# EAGLE design light-meter-B (EAGLE 6.5.0)
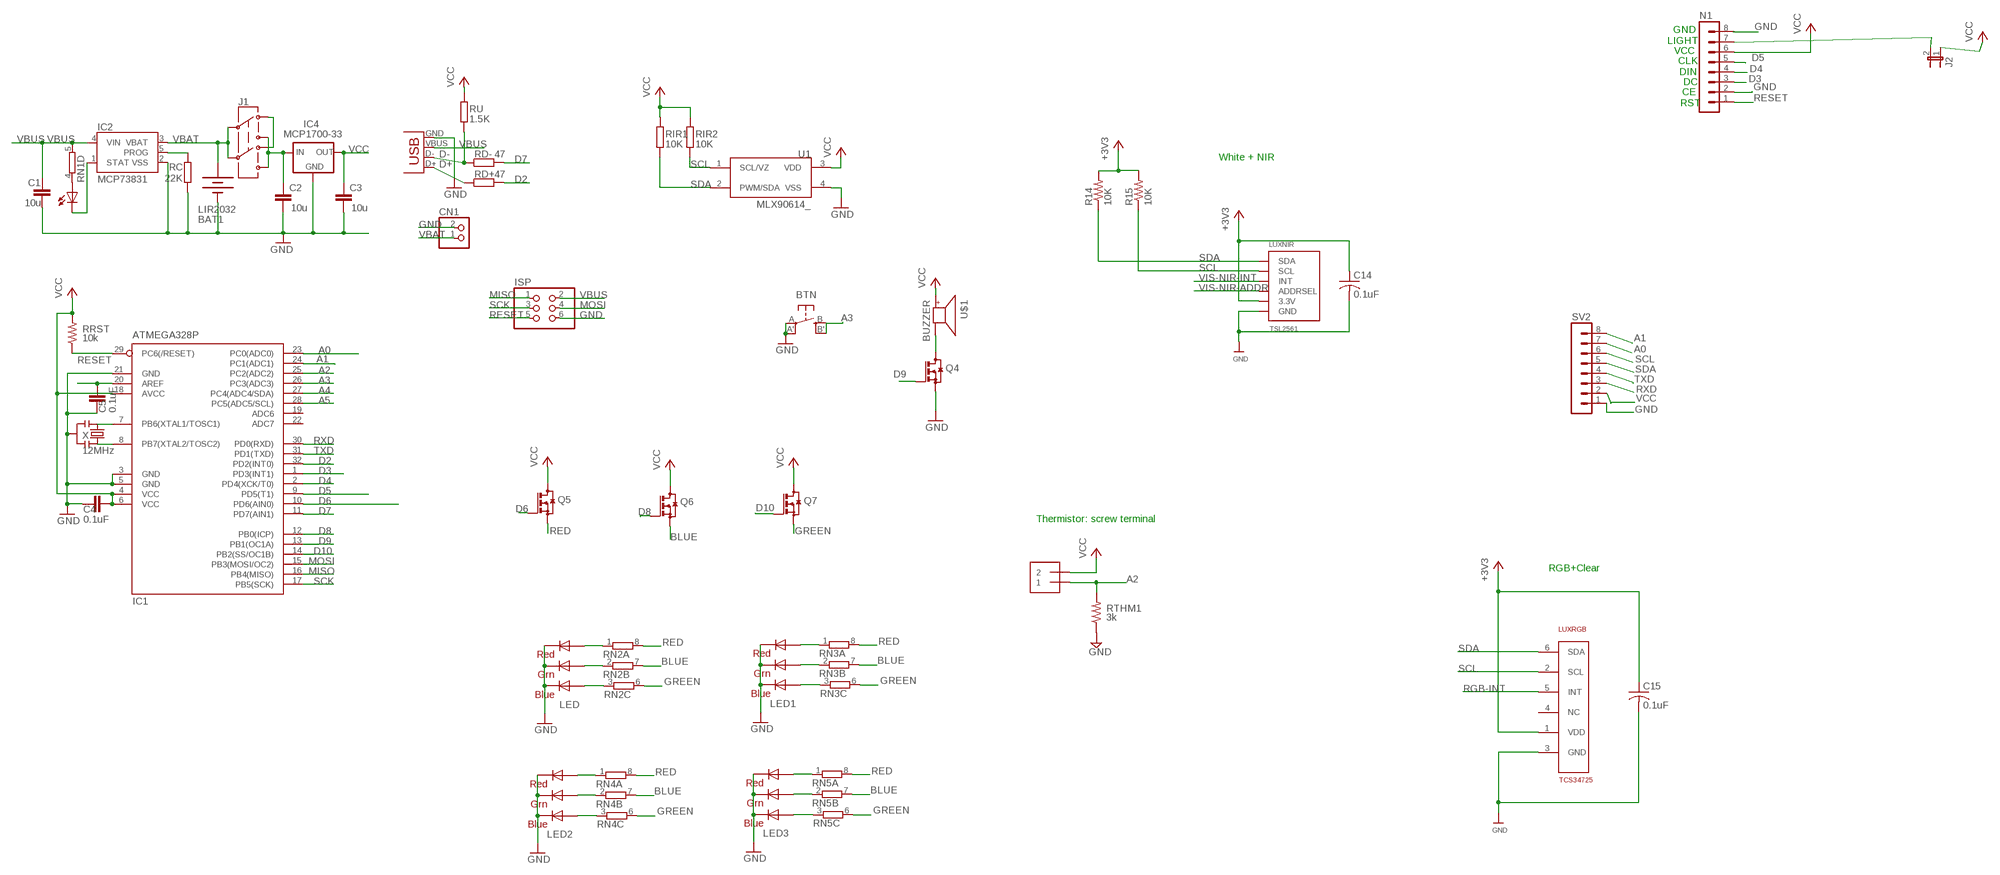
[diagram p0: schematic, sheet 1]

## Parts
BAT1  LIR2032  BATTERYBATTCOM_20MM_PTH_SMT  [BATTCOM_20MM_PTH_SMT]
BTN  EVQQ2  [EVQ-Q2]
C1  10u  C-EUC0805  [C0805]
C2  10u  C-EUC0805  [C0805]
C3  10u  C-EUC0805  [C0805]
C4  0.1uF  C-EUC0805  [C0805]
C5  0.1uF  C-EUC0805  [C0805]
C14  0.1uF  C-USC0805  [C0805]
C15  0.1uF  C-USC0805  [C0805]
CHG  0805  LEDCHIPLED_0805  [CHIPLED_0805]
CN1  JST_2PIN-SMT-RA  [JST-PH-2-SMT-RA]
IC1  ATMEGA328P  MEGA8-AI  [TQFP32-08]
IC2  MCP73831  [SOT23-5]
IC4  MCP1700-33  MCP1700SOT233  [SOT23]
ISP  PINHD-2X3  [2X03]
J1  AYZ0202  [AYZ0202]
J2  JP1E  [JP1]
LED  RGBLED5050  [RGBLED5050]
LED1  RGBLED5050  [RGBLED5050]
LED2  RGBLED5050  [RGBLED5050]
LED3  RGBLED5050  [RGBLED5050]
LUXNIR  TSL2561  [TSL2561_FN@1]
LUXRGB  TCS34725  [DFN-6]
N1  MA08-1  [MA08-1]
Q4  BSS123  [SOT23]
Q5  BSS123  [SOT23]
Q6  BSS123  [SOT23]
Q7  BSS123  [SOT23]
R14  10K  R-US_R0805  [R0805]
R15  10K  R-US_R0805  [R0805]
RC  22K  R-EU_R0805  [R0805]
RD+  47  R-EU_R0805  [R0805]
RD-  47  R-EU_R0805  [R0805]
RIR1  10K  R-EU_R0805  [R0805]
RIR2  10K  R-EU_R0805  [R0805]
RN1  4R-NEXB38V  [EXB38V]
RN2  4R-NEXB38V  [EXB38V]
RN3  4R-NEXB38V  [EXB38V]
RN4  4R-NEXB38V  [EXB38V]
RN5  4R-NEXB38V  [EXB38V]
RRST  10k  R-US_R0805  [R0805@1]
RTHM1  3k  R-US_R0805  [R0805@1]
RU  1.5K  R-EU_R0805  [R0805]
SV2  MA08-1  [MA08-1]
THM1  1X2-3.5MM  [1X2-3.5MM]
U1  MLX90614_  [TO-39]
U$1  BUZZER  [SMT-8585-BUZZER]
X  12MHz  RESONATORSMD  [RESONATOR-SMD]
X1  USBSMD  [USB-MINIB]

## Nets
+3V3: C14.1 C15.1 LUXNIR.VDD(3.3V) LUXRGB.1(VDD) R14.2 R15.2
A0: IC1.23(PC0(ADC0)) SV2.7
A1: IC1.24(PC1(ADC1)) SV2.8
A2: IC1.25(PC2(ADC2)) RTHM1.2 THM1.1
A3: BTN.B'(S1) BTN.B(S) IC1.26(PC3(ADC3))
A4: IC1.27(PC4(ADC4/SDA))
A5: IC1.28(PC5(ADC5/SCL))
AREF: C5.2 IC1.20(AREF)
BLUE: Q6.2(S) RN2.7 RN3.7 RN4.7 RN5.7
D2: IC1.32(PD2(INT0)) RD+.2
D3: IC1.1(PD3(INT1)) N1.3
D4: IC1.2(PD4(XCK/T0)) N1.4
D5: IC1.9(PD5(T1)) N1.5
D6: IC1.10(PD6(AIN0)) Q5.1(G)
D7: IC1.11(PD7(AIN1)) RD-.2
D8: IC1.12(PB0(ICP)) Q6.1(G)
D9: IC1.13(PB1(OC1A)) Q4.1(G)
D10: IC1.14(PB2(SS/OC1B)) Q7.1(G)
D+: RD+.1 X1.D+
D-: RD-.1 RU.1 X1.D-
GND: BAT1.P$1(-) BTN.A'(P1) BTN.A(P) C1.2 C2.2 C3.2 C4.1 C5.1 C14.2 C15.2 CN1.2 IC1.3(GND) IC1.5(GND) IC1.21(GND) IC2.2(VSS) IC4.1(GND) ISP.6 LED1.4(BLUE_C) LED1.5(RED_C) LED1.6(GREEN_C) LED2.4(BLUE_C) LED2.5(RED_C) LED2.6(GREEN_C) LED3.4(BLUE_C) LED3.5(RED_C) LED3.6(GREEN_C) LED.4(BLUE_C) LED.5(RED_C) LED.6(GREEN_C) LUXNIR.VSS(GND) LUXRGB.3(GND) N1.2 N1.8 Q4.2(S) RC.1 RTHM1.1 SV2.1 U1.4(VSS) X1.GND X.2
GREEN: Q7.2(S) RN2.6 RN3.6 RN4.6 RN5.6
MISO: IC1.16(PB4(MISO)) ISP.1
MOSI: IC1.15(PB3(MOSI/OC2)) ISP.4
N$1: J1.3 J1.6
N$2: IC1.7(PB6(XTAL1/TOSC1)) X.1
N$3: IC1.8(PB7(XTAL2/TOSC2)) X.3
N$4: LED.3(BLUE_A) RN2.3
N$5: CHG.C IC2.1(STAT)
N$6: IC2.5(PROG) RC.2
N$7: Q4.3(D) U$1.-
N$8: J2.2 N1.7
N$9: LED.1(GREEN_A) RN2.2
N$10: CHG.A RN1.4
N$11: LED.2(RED_A) RN2.1
N$12: LED1.3(BLUE_A) RN3.3
N$13: LED1.1(GREEN_A) RN3.2
N$14: LED1.2(RED_A) RN3.1
N$15: LED2.3(BLUE_A) RN4.3
N$16: LED2.1(GREEN_A) RN4.2
N$17: LED2.2(RED_A) RN4.1
N$18: LED3.3(BLUE_A) RN5.3
N$19: LED3.1(GREEN_A) RN5.2
N$20: LED3.2(RED_A) RN5.1
RED: Q5.2(S) RN2.8 RN3.8 RN4.8 RN5.8
RESET: IC1.29(PC6(/RESET)) ISP.5 N1.1 RRST.1
RGB-INT: LUXRGB.5(INT)
RXD: IC1.30(PD0(RXD)) SV2.3
SCK: IC1.17(PB5(SCK)) ISP.3
SCL: LUXNIR.CLK(SCL) LUXRGB.2(SCL) R15.1 RIR2.1 SV2.6 U1.1(SCL/VZ)
SDA: LUXNIR.DATA(SDA) LUXRGB.6(SDA) R14.1 RIR1.1 SV2.5 U1.2(PWM/SDA)
TXD: IC1.31(PD1(TXD)) SV2.4
VBAT: BAT1.P$2(+) CN1.1 IC2.3(VBAT) J1.2 J1.5
VBUS: C1.1 IC2.4(VIN) ISP.2 RN1.5 X1.VBUS
VCC: C3.1 C4.2 IC1.4(VCC) IC1.6(VCC) IC1.18(AVCC) IC4.2(OUT) J2.1 N1.6 Q5.3(D) Q6.3(D) Q7.3(D) RIR1.2 RIR2.2 RRST.2 RU.2 SV2.2 THM1.2 U1.3(VDD) U$1.+
VDD: C2.1 IC4.3(IN) J1.1 J1.4
VIS-NIR-ADDR: LUXNIR.ADR(ADDRSEL)
VIS-NIR-INT: LUXNIR.INT
Unconnected: IC1.19(ADC6) IC1.22(ADC7) LUXRGB.4(NC) RN1.1 RN1.2 RN1.3 RN1.6 RN1.7 RN1.8 RN2.4 RN2.5 RN3.4 RN3.5 RN4.4 RN4.5 RN5.4 RN5.5

## Notes on the sheet
- GND
- LIGHT
- VCC
- CLK
- DIN
- DC
- CE
- RST
- White + NIR
- Thermistor: screw terminal
- RGB+Clear

## Library data of the parts
BAT1 = SparkFunNew:BATTERY: Battery Holders Various common sizes : AA, AAA, 20mm coin cell and 12mm coin cell.
BTN = adafruit:EVQQ2: SMT 6mm switch, EVQQ2 series http://www.ladyada.net/library/eagle
C1-C3 = resistor:C-EU: CAPACITOR, European symbol
C4 C5 = rcl:C-EU: CAPACITOR, European symbol
C14 C15 = adafruit:C-US: CAPACITOR, American symbol
CHG = led:LED: LED OSRAM: - CHIPLED LG R971, LG N971, LY N971, LG Q971, LY Q971, LO R971, LY R971 LH N974, LH R974 LS Q976, LO Q976, LY Q976 LO Q996 - Hyper CHIPLED LW Q18S LB Q993, LB Q99A, LB R99A - SideLED LS A670, LO A670, LY A670, LG A670, LP A670 LB A673, LV A673, LT A673, LW A673 LH A674 LY A675 LS A676, LA A676, LO A676, LY A676, LW A676 LS A679, LY A679, LG A679 - Hyper Micro SIDELED® LS Y876, LA Y876, LO Y876, LY Y876 LT Y87S - SmartLED LW L88C, LW L88S LB L89C, LB L89S, LG L890 LS L89K, LO L89K, LY L89K LS L896, LA L896, LO L896, LY L896 - TOPLED LS T670, LO T670, LY T670, LG T670, LP T670 LSG T670, LSP T670, LSY T670, LOP T670, LYG T670 LG T671, LOG T671, LSG T671 LB T673, LV T673, LT T673, LW T673 LH T674 LS T676, LA T676, LO T676, LY T676, LB T676, LH T676, LSB T676, LW T676 LB T67C, LV T67C, LT T67C, LS T67K, LO T67K, LY T67K, LW E67C LS E67B, LA E67B, LO E67B, LY E67B, LB E67C, LV E67C, LT E67C LW T67C LS T679, LY T679, LG T679 LS T770, LO T770, LY T770, LG T770, LP T770 LB T773, LV T773, LT T773, LW T773 LH T774 LS E675, LA E675, LY E675, LS T675 LS T776, LA T776, LO T776, LY T776, LB T776 LHGB T686 LT T68C, LB T68C - Hyper Mini TOPLED® LB M676 - Mini TOPLED Santana® LG M470 LS M47K, LO M47K, LY M47K Source: http://www.osram.convergy.de LUXEON: - LUMILED® LXK2-PW12-R00, LXK2-PW12-S00, LXK2-PW14-U00, LXK2-PW14-V00 LXK2-PM12-R00, LXK2-PM12-S00, LXK2-PM14-U00 LXK2-PE12-Q00, LXK2-PE12-R00, LXK2-PE12-S00, LXK2-PE14-T00, LXK2-PE14-U00 LXK2-PB12-K00, LXK2-PB12-L00, LXK2-PB12-M00, LXK2-PB14-N00, LXK2-PB14-P00, LXK2-PB14-Q00 LXK2-PR12-L00, LXK2-PR12-M00, LXK2-PR14-Q00, LXK2-PR14-R00 LXK2-PD12-Q00, LXK2-PD12-R00, LXK2-PD12-S00 LXK2-PH12-R00, LXK2-PH12-S00 LXK2-PL12-P00, LXK2-PL12-Q00, LXK2-PL12-R00 Source: www.luxeon.com KINGBRIGHT: KA-3528ASYC Source: www.kingbright.com
CN1 = adafruit:JST_2PIN: JST 2-Pin Connectors of various flavors SMT-RA (S2B-PH-SM4) 4UConnector #17311 SMT (B2B-PH-SM4) THM-RA (S2B-PH) THM (B2B-PH)
IC1 = atmel:MEGA8: MICROCONTROLLER 8 Kbytes FLASH, 1 kbytes SRAM, 512 bytes EEPROM, USART, 6-channel 10 bit ADC, 2-channel 8 bit ADC Pin compatible with Atmega48, ATMega88, ATMega168 Source: avr.lbr; MPN: ATMEGA8-16AU; OC_FARNELL: 9171371; OC_NEWARK: 73M8863
IC2 = SparkFunNew:MCP73831: Microchip's MCP73831 Miniature single cell, fully integrated Li-Ion, Li-polymer charge management controller http://ww1.microchip.com/downloads/en/DeviceDoc/21984a.pdf
IC4 = adafruit:MCP1700: VOLTAGE REGULATOR
ISP = pinhead:PINHD-2X3: PIN HEADER
J1 = SparkFunNew:AYZ0202: SPDT Slide Switch Simple SMD single-pull double-throw slide switch. Good for less than 350mA power switch, switching UARTs between devices, etc. Spark Fun Electronics SKU : COM-00597
J2 = jumper:JP1E: JUMPER
LED LED1-LED3 = adafruit:RGBLED: For 5050 RGB LEDs, the order of the LEDs may vary from one manufacturer to another!
LUXNIR = microbuilder:TSL2561: TSL2561 Light-To-Digital Sensor Mouser Part Numbers: CS (obsolete): 856-TSL2561CS DFN (cheapest): 856-TSL2561FN
LUXRGB = dwbLibrary:TCS34725
N1 SV2 = con-lstb:MA08-1: PIN HEADER; OC_FARNELL: unknown; OC_NEWARK: unknown
Q4-Q7 = transistor-small-signal:BSS123: N-CHANNEL MOS FET
R14 R15 = adafruit:R-US_: RESISTOR, American symbol
RC RD+ RD- RIR1 RIR2 RU = rcl:R-EU_: RESISTOR, European symbol
RN1-RN5 = resistor-dil:4R-N: Array Chip Resistor Source: RS Component / Phycomp; OC_FARNELL: unknown; OC_NEWARK: unknown
RRST RTHM1 = rcl:R-US_: RESISTOR, American symbol
THM1 = adafruit:1X2: 3.5mm Terminal block http://www.ladyada.net/library/pcb/eaglelibrary.html
U1 = SparkFun:MLX90614: Melexis IR Thermometer
U$1 = adafruit:BUZZER
X = SparkFunNew:RESONATOR: Resonator Small SMD resonator. This is the itty bitty 10/20MHz resonators with built in caps. CSTCE10M0G55 and CSTCE20M0V53. Footprint has been reviewed closely but hasn't been tested yet.
X1 = SparkFun:USB: USB Connectors USB-B-PTH is fully proven SKU : PRT-00139 USB-miniB is fully proven SKU : PRT-00587 USB-A-PCB is untested. USB-A-H is throughly reviewed, but untested. Spark Fun Electronics SKU : PRT-00437 USB-B-SMT is throughly reviewed, but untested. Needs silkscreen touching up. USB-A-S has not been used/tested USB-MB-H has not been used/tested

## Net classes
0 default: width 0.203 mm, clearance 0.203 mm
1 power: width 0.254 mm, clearance 0.203 mm

## Board
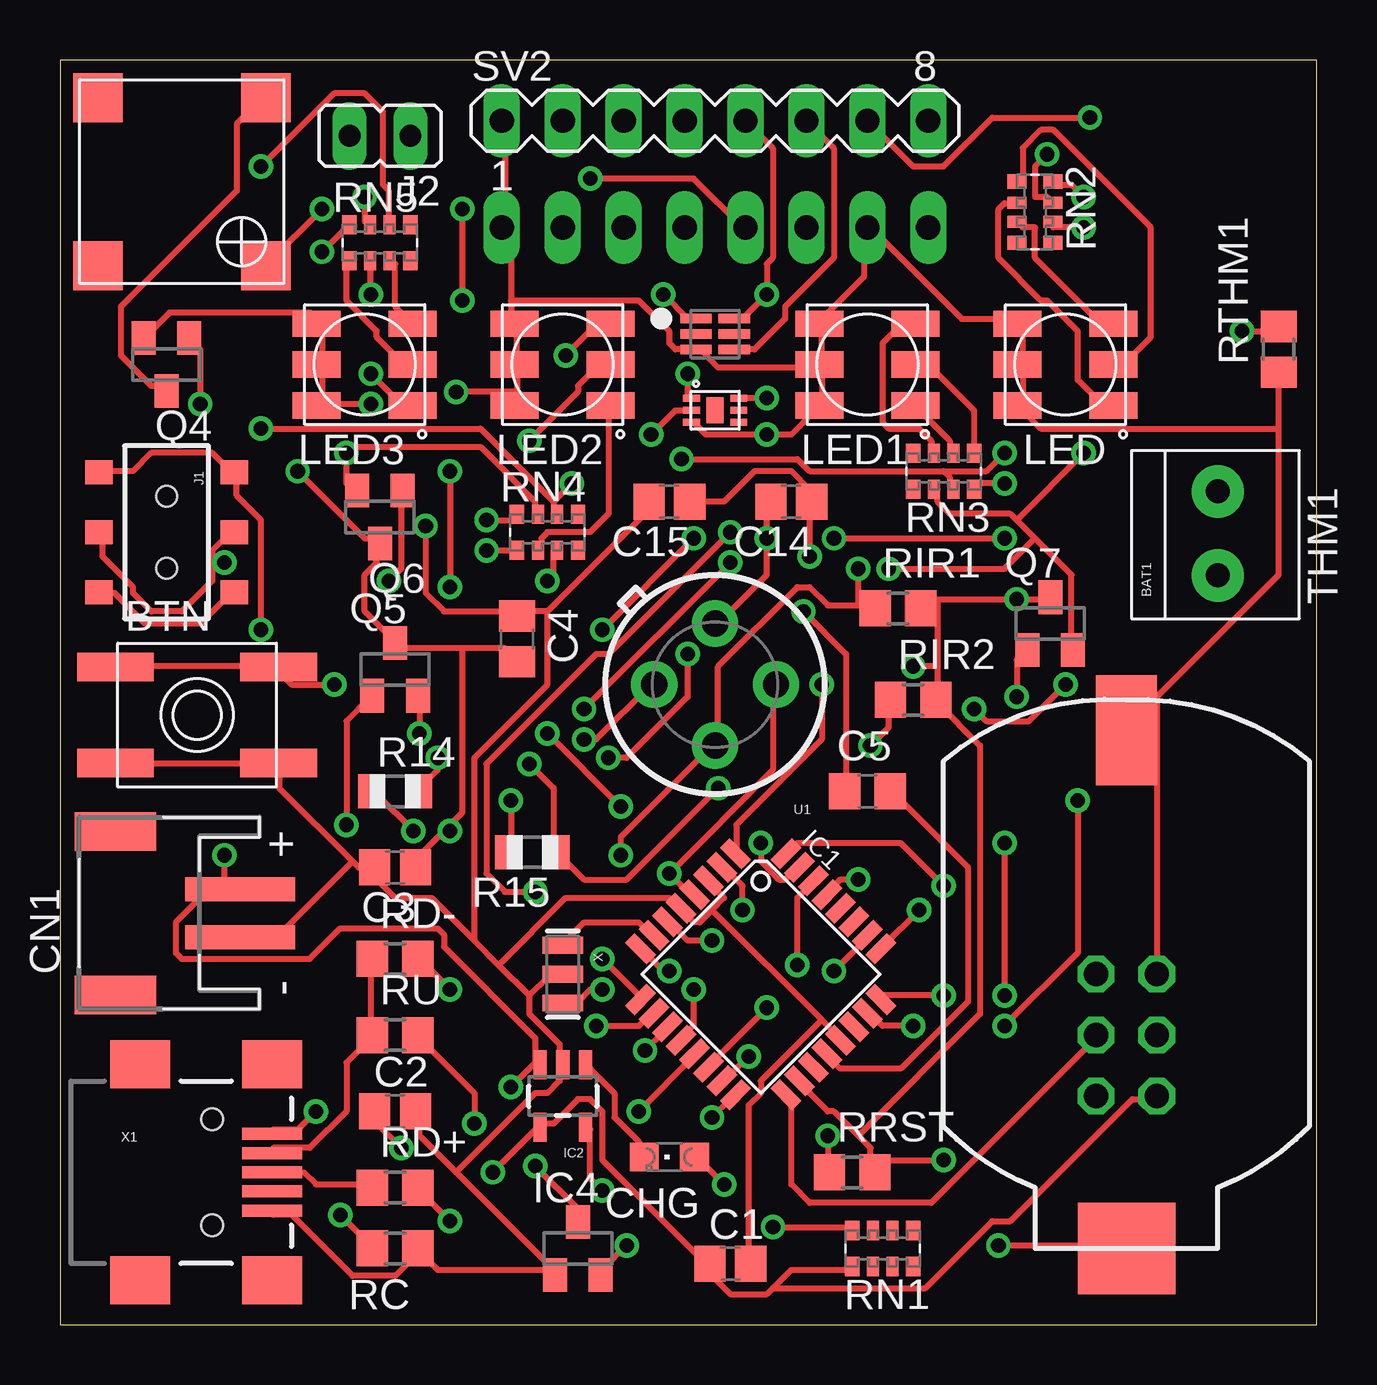
[diagram p1: board, top side]
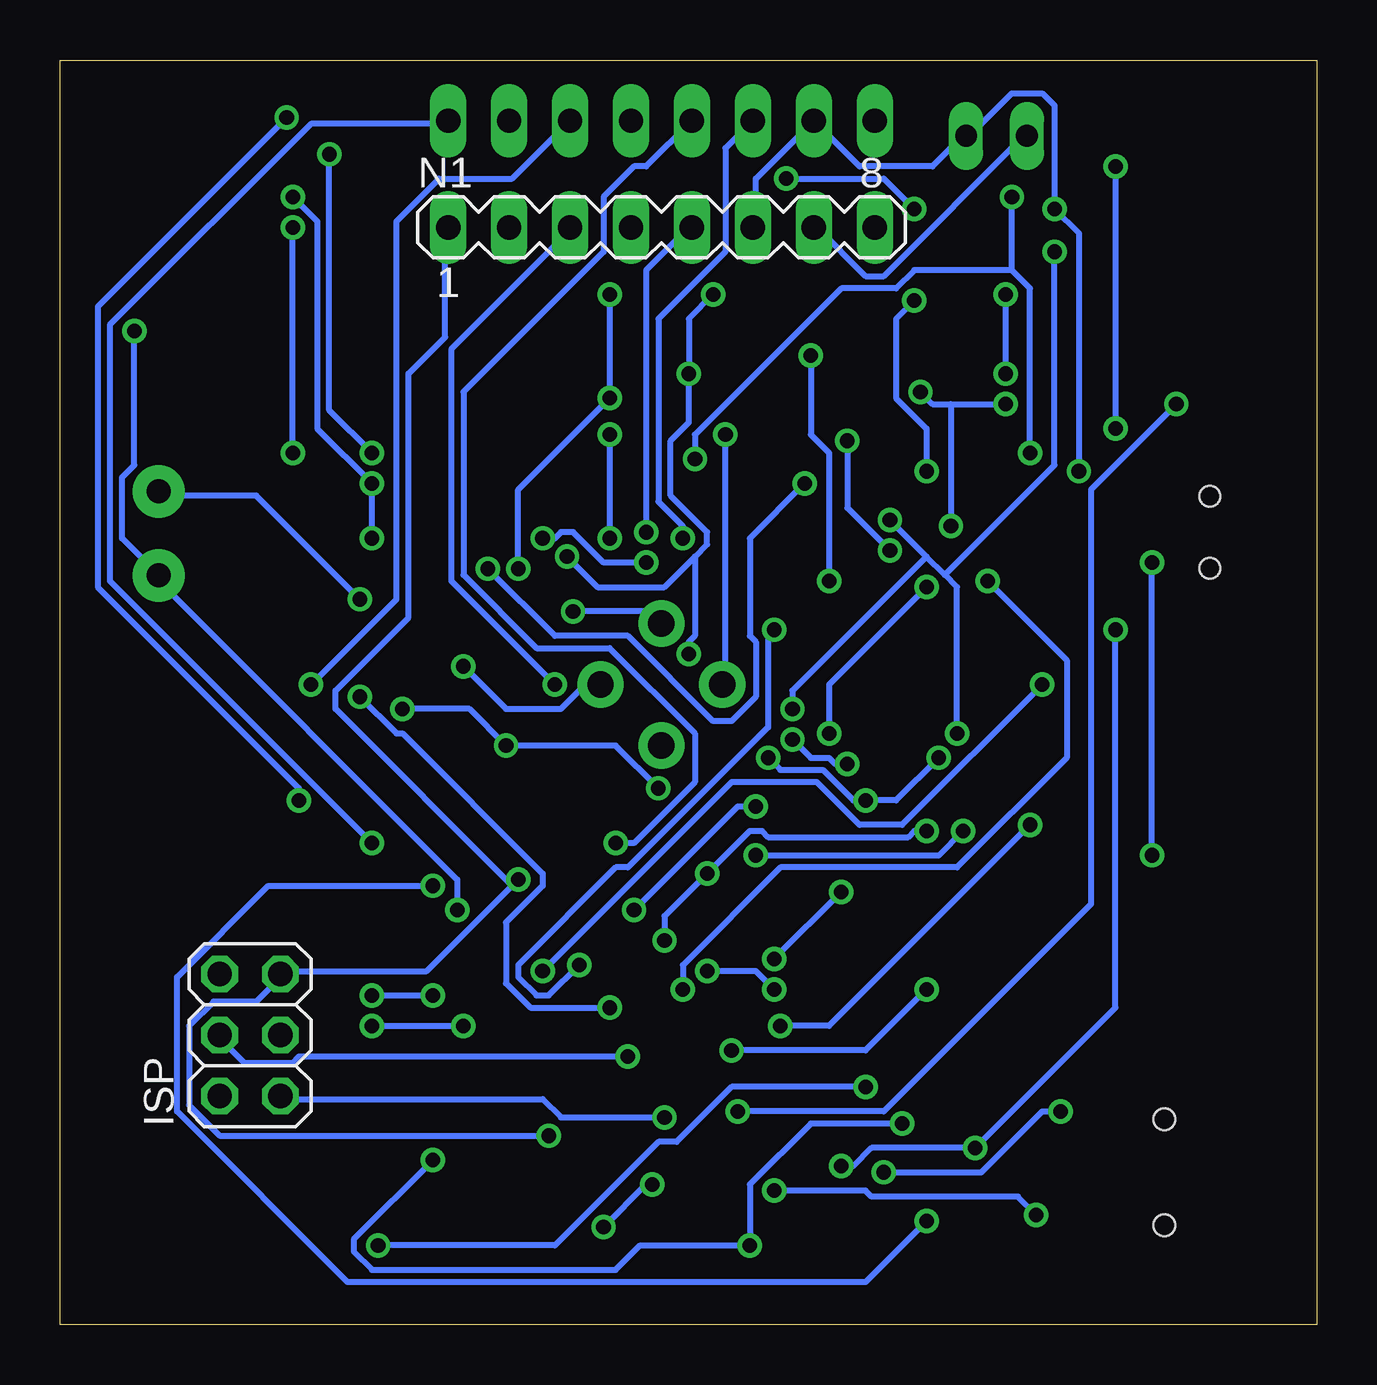
[diagram p2: board, bottom side, seen from below]

Size 52.38 x 52.7 mm. Coordinates in mm from the lower left corner, seen from the top.
Outline: 0,0 52.38,0 52.38,52.7 0,52.7 0,0
Copper layers (1*16): Top 0.035mm / dielectric 1.5mm / Bottom 0.035mm
Design rules "default": minimum track width 10mil, minimum drill 24mil, track to track 8mil, track to pad 8mil, pad to pad 8mil, via to via 8mil, smd to smd 8mil, copper to edge 40mil, drill to drill 8mil, minimum pad ring 10mil, minimum via ring 8mil, stop-mask expansion 4mil, vias tented up to drill 0mil, thermal gap 10mil

### Footprints (pad centres in the part's own frame; a part is rotated, then mirrored left to right if it is on the bottom)
BATTCOM_20MM_PTH_SMT = smd 4.572 x 2.54: P$1 0,0 | smd 3.81 x 4.064: P$2 21.59,0
EVQ-Q2 = smd 3.2 x 1.2: A -3.4,-2; A' 3.4,-2; B -3.4,2; B' 3.4,2
C0805 = smd 1.3 x 1.5: 1 -0.85,0; 2 0.85,0
C0805' = smd 1.3 x 1.5: 1 -0.95,0; 2 0.95,0
CHIPLED_0805 = smd 1.2 x 1.2: A 0,-1.05; C 0,1.05
JST-PH-2-SMT-RA = smd 1 x 4.6: 1 1,-3.7; 2 -1,-3.7 | smd 1.6 x 3.4: NC1 -3.4,1.5; NC2 3.4,1.5
TQFP32-08 = smd 1.27 x 0.559: 1 -4.293,2.8; 2 -4.293,2; 3 -4.293,1.2; 4 -4.293,0.4; 5 -4.293,-0.4; 6 -4.293,-1.2; 7 -4.293,-2; 8 -4.293,-2.8; 17 4.293,-2.8; 18 4.293,-2; 19 4.293,-1.2; 20 4.293,-0.4; 21 4.293,0.4; 22 4.293,1.2; 23 4.293,2; 24 4.293,2.8 | smd 0.559 x 1.27: 9 -2.8,-4.293; 10 -2,-4.293; 11 -1.2,-4.293; 12 -0.4,-4.293; 13 0.4,-4.293; 14 1.2,-4.293; 15 2,-4.293; 16 2.8,-4.293; 25 2.8,4.293; 26 2,4.293; 27 1.2,4.293; 28 0.4,4.293; 29 -0.4,4.293; 30 -1.2,4.293; 31 -2,4.293; 32 -2.8,4.293
SOT23-5 = smd 0.55 x 1.2: 1 -0.95,-1.3; 2 0,-1.3; 3 0.95,-1.3; 4 0.95,1.3; 5 -0.95,1.3
SOT23 = smd 1 x 1.4: 1 -0.95,-1.1; 2 0.95,-1.1; 3 0,1.1
2X03 = drill 1.016 octagon: 1 -2.54,-1.27; 2 -2.54,1.27; 3 0,-1.27; 4 0,1.27; 5 2.54,-1.27; 6 2.54,1.27
AYZ0202 = smd 1 x 1.15: 1 -2.5,2.825; 2 0,2.825; 3 2.5,2.825; 4 -2.5,-2.825; 5 0,-2.825; 6 2.5,-2.825 | hole 0.85: 1.5,0; -1.5,0
JP1 = drill 0.914 long: 1 0,-1.27; 2 0,1.27
RGBLED5050 = smd 2 x 1.1: 1 -2,1.7; 2 -2,0; 3 -2,-1.7; 4 2,-1.7; 5 2,0; 6 2,1.7
TSL2561_FN@1 = smd 1.3 x 0.4: ADR -0.8,0; CLK 0.8,-0.65; DATA 0.8,0.65; INT 0.8,0; VDD -0.8,0.65; VSS -0.8,-0.65
DFN-6 = smd 0.28 x 0.7: 1 -0.5,-0.988; 2 0,-0.988; 3 0.5,-0.988; 4 0.5,0.988; 5 0,0.988; 6 -0.5,0.988 | smd 1.1 x 0.7: P$1 0,0
MA08-1 = drill 1.016 long: 1 -8.89,0; 2 -6.35,0; 3 -3.81,0; 4 -1.27,0; 5 1.27,0; 6 3.81,0; 7 6.35,0; 8 8.89,0
R0805 = smd 1.1 x 1.4: 1 -1,0; 2 1,0
R0805' = smd 1.3 x 1.5: 1 -0.95,0; 2 0.95,0
EXB38V = smd 0.6 x 0.8: 1 -1.275,-0.75; 4 1.275,-0.75; 5 1.275,0.75; 8 -1.275,0.75 | smd 0.5 x 0.8: 2 -0.4,-0.75; 3 0.4,-0.75; 6 0.4,0.75; 7 -0.4,0.75
R0805@1 = smd 1.3 x 1.5: 1 -0.95,0; 2 0.95,0
1X2-3.5MM = drill 1 pad 2.184: 1 1.8,0; 2 -1.7,0
TO-39 = drill 1.1 pad 1.93: 1 2.54,0; 2 0,2.54; 3 -2.54,0; 4 0,-2.54
SMT-8585-BUZZER = smd 2.05 x 2.05: + -3.5,-3.5; - 3.5,-3.5; NC1 -3.5,3.5; NC2 3.5,3.5
RESONATOR-SMD = smd 0.7 x 1.7: 1 -1.2,0; 2 0,0; 3 1.2,0
USB-MINIB = smd 2.5 x 0.5: D+ 2.5,0; D- 2.5,0.8; GND 2.5,-1.6; ID 2.5,-0.8; VBUS 2.5,1.6 | smd 2.5 x 2: GND@1 -3,-4.5; GND@2 -3,4.5; GND@3 2.5,4.5; GND@4 2.5,-4.5 | hole 0.9: 0,2.2; 0,-2.2

### Placement (x,y rotation side)
BAT1  44.45,24.77 270 top
BTN  5.71,25.4 0 top
C1  27.94,2.54 0 top
C2  13.97,8.89 0 top
C3  13.97,19.05 180 top
C4  0.1uF  [C0805']  19.05,28.57 270 top
C5  0.1uF  [C0805']  33.66,22.23 0 top
C14  30.48,34.29 180 top
C15  25.4,34.29 180 top
CHG  25.4,6.99 90 top
CN1  3.81,17.14 90 top
IC1  29.21,14.61 315 top
IC2  20.95,9.53 180 top
IC4  21.59,3.17 0 top
ISP  44.45,12.06 90 bottom
J1  4.45,33.02 270 top
J2  13.34,49.53 90 top
LED  41.91,40.01 180 top
LED1  33.66,40.01 180 top
LED2  20.95,40.01 180 top
LED3  12.7,40.01 180 top
LUXNIR  27.3,41.27 0 top
LUXRGB  27.3,38.1 270 top
N1  27.3,45.72 0 bottom
Q4  4.45,40.01 180 top
Q5  13.97,27.3 0 top
Q6  13.34,33.66 180 top
Q7  41.27,29.21 0 top
R14  13.97,22.23 0 top
R15  19.68,19.68 180 top
RC  22K  [R0805']  13.97,3.17 180 top
RD+  47  [R0805']  13.97,5.71 0 top
RD-  47  [R0805']  13.97,15.24 0 top
RIR1  10K  [R0805']  34.92,29.84 0 top
RIR2  10K  [R0805']  35.56,26.04 0 top
RN1  34.29,3.17 180 top
RN2  40.64,46.35 270 top
RN3  36.83,35.56 180 top
RN4  20.32,33.02 0 top
RN5  13.34,45.09 0 top
RRST  33.02,6.35 0 top
RTHM1  50.8,40.64 90 top
RU  1.5K  [R0805']  13.97,12.06 0 top
SV2  27.3,50.16 0 top
THM1  48.26,33.02 270 top
U1  27.3,26.67 180 top
U$1  5.08,47.62 90 top
X  20.95,14.61 270 top
X1  6.35,6.35 0 top

### Tracks (layer width: path | path; a pad name or v marks a point on that pad's centre or on a via)
+3V3  (via drill 0.61)
  Top 0.254: v18.8,21.84 18.8,19.81 R15.2 | v15.75,23.62 15.75,23.11 14.99,22.35 R14.2 | v26.16,39.62 26.16,38.61 LUXRGB.1 | v25.15,42.93 26.16,41.91 26.42,41.91 LUXNIR.VDD | C15.1 27.69,34.29 28.96,35.56 30.48,35.56 31.24,34.8 31.24,34.29 | 31.24,34.29 v31.24,32 | 31.24,34.29 C14.1 | v22.86,23.62 23.62,23.62 26.16,26.16 v26.16,27.94
  Bottom 0.254: v15.75,23.62 17.53,21.84 v18.8,21.84 19.3,21.84 20.57,23.11 22.35,23.11 v22.86,23.62 | v25.15,42.93 26.16,41.91 v26.16,39.62 26.16,37.59 26.92,36.83 26.92,34.54 25.4,33.02 25.4,32.51 25.91,32 | 25.91,32 27.18,30.73 29.97,30.73 v31.24,32 | v26.16,27.94 26.16,28.45 25.91,28.7 25.91,32
A0  (via drill 0.61)
  Top 0.254: v35.56,12.45 34.29,12.45 33.78,12.95 IC1.23 | v39.37,12.45 42.42,15.49 v42.42,21.84 | v42.93,50.29 38.86,50.29 36.83,48.26 35.56,48.26 SV2.7
  Bottom 0.254: v39.37,12.45 v35.56,12.45 | v42.42,21.84 42.42,22.35 50.8,30.73 50.8,42.42 v42.93,50.29
A1  (via drill 0.61)
  Top 0.254: v36.83,13.72 34.29,13.72 IC1.24 | v39.37,20.07 v39.37,13.72
  Bottom 0.254: v39.37,13.72 v36.83,13.72 | v39.37,20.07 50.29,30.99 50.29,41.66 41.91,50.04 36.32,50.04 SV2.8
A2  (via drill 0.61)
  Top 0.254: v35.81,17.27 34.29,15.75 IC1.25 | v49.28,41.4 50.8,41.4 RTHM1.2
  Bottom 0.254: v35.81,17.27 35.81,18.54 48.26,30.99 THM1.1 48.26,31.24 49.78,32.77 49.78,35.31 49.28,35.81 v49.28,41.4
A3  (via drill 0.61)
  Top 0.254: v32.26,14.73 33.53,16 IC1.26 | v11.43,26.67 9.65,26.67 9.14,27.18 BTN.B' 8.89,27.43 2.54,27.43 BTN.B
  Bottom 0.254: v32.26,14.73 24.38,22.61 20.83,22.61 19.05,20.83 17.27,20.83 v11.43,26.67
AREF
  Top 0.254: IC1.20 32,11.18 32.51,10.67 35.05,10.67 37.85,13.46 37.85,19.05 34.8,22.1 C5.2
BLUE  (via drill 0.61)
  Top 0.254: v12.7,46.99 12.7,45.97 RN5.7 | Q6.2 12.19,34.8 11.94,35.05 v11.94,36.32 12.19,36.58 17.53,36.58 19.81,34.29 19.81,33.78 RN4.7 | 36.83,35.56 37.08,35.31 37.08,35.05 RN3.7 | 36.83,35.56 31.24,35.56 30.73,36.07 v25.91,36.07 | v41.15,48.77 40.64,48.26 40.64,46.99 41.15,46.99 RN2.7 | v39.37,36.32 38.61,35.56 36.83,35.56
  Bottom 0.254: 12.7,43.94 v12.7,46.99 | 12.7,43.94 11.94,43.18 v11.94,36.32 | v25.91,36.07 25.91,37.08 19.81,43.18 17.53,43.18 16.76,43.94 12.7,43.94 | v41.15,48.77 41.15,38.1 v39.37,36.32
D2  (via drill 0.61)
  Top 0.254: v36.83,18.29 35.05,20.07 30.73,20.07 30.48,19.81 IC1.32 | v16.26,4.32 14.99,5.59 RD+.2
  Bottom 0.254: v36.83,18.29 43.69,18.29 47.5,14.48 47.5,8.89 40.39,1.78 18.8,1.78 v16.26,4.32
D3  (via drill 0.61)
  Top 0.254: v31.75,26.67 31.75,24.38 28.19,20.83 28.19,19.81 IC1.1
  Bottom 0.254: v31.75,26.67 36.07,30.99 36.07,40.64 30.99,45.72 N1.3
D4  (via drill 0.61)
  Top 0.254: v28.45,17.27 28.45,18.29 27.69,19.05 IC1.2 | v20.32,24.64 v23.37,21.59 | v16.26,35.56 v16.26,30.73 | v16.76,46.48 v16.76,42.67 | v22.1,47.75 26.42,47.75 28.45,45.72 N1.4
  Bottom 0.254: v28.45,17.27 24.13,21.59 v23.37,21.59 | v20.32,24.64 20.32,26.67 v16.26,30.73 | v16.26,35.56 16.26,37.34 17.53,38.61 17.53,41.91 v16.76,42.67 | v16.76,46.48 18.03,47.75 v22.1,47.75
D5  (via drill 0.61)
  Top 0.254: v22.61,15.24 24.13,13.72 IC1.9 | v19.81,18.03 18.54,18.03 17.78,18.8 17.78,23.37 22.35,27.94 22.86,27.94 v27.94,33.02
  Bottom 0.254: v19.81,18.03 v22.61,15.24 | v27.94,33.02 27.94,43.94 26.16,45.72 N1.5
D6  (via drill 0.61)
  Top 0.254: v22.35,12.45 24.13,12.45 24.64,12.95 IC1.10 | v11.94,20.83 11.94,25.15 12.95,26.16 Q5.1
  Bottom 0.254: v22.35,12.45 20.32,12.45 v11.94,20.83
D7  (via drill 0.61)
  Top 0.254: v24.38,11.43 25.15,12.19 IC1.11 | v16.26,13.97 14.99,15.24 RD-.2
  Bottom 0.254: v24.38,11.43 18.8,11.43 v16.26,13.97
D8  (via drill 0.61)
  Top 0.254: v26.42,13.97 26.42,12.45 25.91,11.94 IC1.12 | v13.72,30.99 14.22,31.5 14.22,34.54 Q6.1
  Bottom 0.254: v26.42,13.97 26.42,14.99 22.35,19.05 14.99,19.05 10.41,23.62 10.41,27.69 v13.72,30.99
D9  (via drill 0.61)
  Top 0.254: v24.13,8.89 26.42,11.18 IC1.13 | v5.84,38.35 5.84,40.64 5.59,40.89 Q4.1
  Bottom 0.254: v24.13,8.89 18.03,8.89 9.4,17.53 9.4,34.8 v5.84,38.35
D10  (via drill 0.61)
  Top 0.254: v29.46,13.21 27.18,10.92 IC1.14 | v39.88,26.16 39.88,27.69 40.13,27.94 Q7.1
  Bottom 0.254: v29.46,13.21 32.77,13.21 33.78,14.22 33.78,16.76 32.26,18.29 32.26,18.8 38.1,24.64 38.35,24.64 v39.88,26.16
D+
  Top 0.254: X1.D+ 10.16,6.35 10.67,5.84 12.95,5.84 RD+.1
D-
  Top 0.254: RD-.1 12.95,15.24 12.95,12.19 RU.1 12.95,11.94 11.94,10.92 11.94,8.89 10.41,7.37 8.89,7.37 X1.D-
GND  (via drill 0.61)
  Top 0.254: 27.18,17.27 27.69,17.78 27.18,18.29 IC1.3 | 27.18,17.27 26.67,16.76 26.42,16.76 25.91,17.27 IC1.5 25.65,17.53 25.4,17.78 21.08,17.78 18.29,14.99 | 27.18,17.27 31.75,12.7 | 31.75,12.7 32.51,11.94 IC1.21 | 31.75,12.7 29.21,10.16 29.21,9.65 28.7,9.14 28.7,2.54 C1.2 | 20.57,2.29 15.75,2.29 14.99,3.05 | 20.57,2.29 16.51,6.35 | 16.51,6.35 14.99,7.87 14.99,8.89 C2.2 | 20.57,2.29 IC4.1 | 14.99,3.05 13.97,2.03 12.19,2.03 9.65,4.57 8.89,4.57 X1.GND | 14.99,3.05 RC.1 | 20.32,29.72 19.05,29.72 | 20.32,29.72 24.38,33.78 24.38,34.29 C15.2 | 19.56,13.72 19.56,12.95 20.83,11.68 20.83,10.92 IC2.2 20.83,10.67 20.83,10.16 20.32,9.65 19.81,9.65 16.51,6.35 | 19.56,13.72 20.32,14.48 20.83,14.48 X.2 | 12.7,19.05 12.45,19.05 12.19,19.3 | 12.7,19.05 C3.2 12.95,19.05 | 12.19,19.3 9.14,22.35 9.14,23.37 BTN.A' 8.89,23.37 2.54,23.37 BTN.A | 17.27,16 15.49,17.78 13.97,17.78 12.7,19.05 | 17.27,16 18.29,14.99 | 18.29,14.99 19.56,13.72 | 12.19,19.3 9.14,16.26 7.62,16.26 CN1.2 | 20.32,29.72 20.32,26.67 17.27,23.62 17.27,16 | 50.8,37.34 50.8,31.24 45.72,26.16 | 50.8,37.34 RTHM1.1 | 45.72,26.16 44.45,24.89 BAT1.P$1 | 45.72,26.16 ISP.6 | 10.92,38.35 10.92,39.88 LED3.5 10.92,40.13 10.92,41.66 LED3.4 10.67,41.91 10.41,42.16 4.57,42.16 3.56,41.15 Q4.2 | 19.05,38.86 19.05,39.88 LED2.5 19.05,40.13 19.05,41.66 LED2.4 18.8,41.91 18.8,42.67 | 19.05,38.86 19.05,38.35 LED2.6 | 18.54,45.72 18.54,50.04 SV2.1 | 18.8,42.67 18.8,45.47 18.54,45.72 | 18.54,45.72 N1.8 | v12.95,38.35 10.92,38.35 | 19.05,38.86 v16.51,38.86 | 10.92,38.35 LED3.6 | C14.2 29.46,34.29 v29.46,32.77 29.46,31.24 27.43,29.21 U1.4 | v30.99,29.72 32.77,27.94 32.77,22.35 C5.1
  Top 0.254: LUXRGB.3 26.42,37.59 26.92,37.08 v29.46,37.08 30.48,37.08 31.5,38.1 LED1.6 31.75,38.35 31.75,39.88 LED1.5 | LED1.5 31.5,39.88 27.43,39.88 26.67,40.64 LUXNIR.VSS 26.42,40.64 25.65,40.64 25.4,40.89 25.4,41.4 24.13,42.67 18.8,42.67 | LED1.5 31.75,40.13 31.75,41.66 LED1.4 31.75,41.91 33.53,43.69 33.53,45.72 N1.2 33.78,45.72 37.59,41.91 39.88,41.91 LED.4 40.13,41.66 40.13,40.13 LED.5 40.13,39.88 40.13,38.35 LED.6 40.13,38.1 40.89,37.34 50.8,37.34 | 19.05,29.72 16,29.72 15.24,30.48 v15.24,33.27 | 19.05,29.72 C4.1
  Bottom 0.254: 15.24,38.35 16,38.35 v16.51,38.86 | 15.24,38.35 v12.95,38.35 | v30.99,29.72 27.94,29.72 27.43,29.21 U1.4 | v29.46,37.08 v29.46,32.77 | 15.24,38.35 v15.24,33.27
GREEN  (via drill 0.61)
  Top 0.254: 40.64,32.77 42.16,31.24 42.16,28.19 Q7.2 | 40.64,32.77 39.88,33.53 | 39.88,33.53 39.62,33.78 37.08,33.78 36.58,34.29 36.58,34.8 RN3.6 | v42.67,45.72 41.4,45.72 RN2.6 | 39.88,33.53 v42.67,36.32 | 20.57,34.29 20.57,33.78 RN4.6 | 20.57,34.29 17.53,37.34 v8.38,37.34 | v8.38,48.26 11.43,51.31 12.7,51.31 13.46,50.55 13.46,47.5 13.72,47.24 13.72,45.97 RN5.6 | 40.64,32.77 39.37,31.5 v34.54,31.5 | 20.57,34.29 v21.34,35.05
  Bottom 0.254: v42.67,36.32 v42.67,45.72 | v8.38,48.26 v8.38,37.34 | v34.54,31.5 31.75,28.7 28.7,28.7 25.15,25.15 24.38,25.15 23.37,26.16 23.37,28.45 23.62,28.7 23.62,32.77 v21.34,35.05
MISO  (via drill 0.61)
  Top 0.254: v27.18,8.64 27.94,9.4 IC1.16
  Bottom 0.254: v27.18,8.64 31.5,8.64 32.26,9.4 43.18,9.4 ISP.1
MOSI  (via drill 0.61)
  Top 0.254: v28.7,11.18 27.69,10.16 IC1.15
  Bottom 0.254: v28.7,11.18 42.42,11.18 42.67,10.92 44.7,10.92 45.72,11.94 ISP.4
N$1
  Top 0.254: J1.6 1.78,30.48 2.29,30.48 3.56,29.21 5.84,29.21 7.11,30.48 J1.3
N$2
  Top 0.254: IC1.7 24.64,16.26 24.13,16.76 21.84,16.76 21.08,16 X.1
N$3  (via drill 0.61)
  Top 0.254: v25.4,14.73 25.15,14.73 24.38,15.49 IC1.8 | v22.61,13.97 22.1,13.97 21.59,13.46 21.08,13.46 X.3
  Bottom 0.254: v25.4,14.73 23.37,14.73 v22.61,13.97
N$4
  Top 0.254: RN2.3 40.13,45.72 40.64,45.72 40.64,44.45 43.18,41.91 43.69,41.91 LED.3
N$5
  Top 0.254: CHG.C 24.13,7.11 24.13,7.62 23.11,8.64 23.11,9.65 22.1,10.67 IC2.1
N$6  (via drill 0.61)
  Top 0.254: v22.61,5.59 22.1,6.1 22.1,8.13 IC2.5 | v11.68,4.57 12.95,3.3 RC.2
  Bottom 0.254: v22.61,5.59 18.8,5.59 18.54,5.33 12.45,5.33 v11.68,4.57
N$7
  Top 0.254: Q4.3 4.32,39.12 3.81,39.12 2.54,40.39 2.54,42.42 7.37,47.24 7.37,50.04 8.38,51.05 U$1.-
N$8
  Bottom 0.254: J2.2 12.19,49.53 18.03,43.69 18.8,43.69 20.83,45.72 N1.7
N$9
  Top 0.254: RN2.2 39.88,46.74 39.37,46.74 39.12,46.48 39.12,44.45 40.89,42.67 41.15,42.67 42.42,41.4 42.42,39.37 43.69,38.1 LED.1
N$10  (via drill 0.61)
  Top 0.254: v29.72,4.06 32.77,4.06 RN1.4 | v27.69,5.84 26.67,6.86 CHG.A
  Bottom 0.254: v29.72,4.06 27.94,5.84 v27.69,5.84
N$11
  Top 0.254: RN2.1 40.13,47.75 40.13,49.02 40.89,49.78 41.4,49.78 45.47,45.72 45.47,41.15 44.45,40.13 43.94,40.13 LED.2
N$12
  Top 0.254: RN3.3 36.32,36.32 36.32,36.83 35.81,37.34 34.54,37.34 34.29,37.59 34.29,40.89 35.05,41.66 35.56,41.66 LED1.3
N$13
  Top 0.254: RN3.2 37.08,36.32 37.08,36.83 35.81,38.1 LED1.1
N$14
  Top 0.254: RN3.1 38.1,36.32 38.1,38.1 36.32,39.88 35.81,39.88 LED1.2
N$15  (via drill 0.61)
  Top 0.254: v20.32,30.99 20.57,31.24 20.57,32.26 RN4.3 | v21.08,40.39 22.35,41.66 22.86,41.66 LED2.3
  Bottom 0.254: v20.32,30.99 20.32,36.32 21.08,37.08 v21.08,40.39
N$16
  Top 0.254: RN4.2 20.07,32.51 20.07,32.77 20.32,33.02 22.1,33.02 22.86,33.78 22.86,38.1 LED2.1
N$17  (via drill 0.61)
  Top 0.254: v17.78,32.26 18.8,32.26 RN4.1 | v19.56,36.83 21.59,38.86 21.59,39.12 22.35,39.88 22.86,39.88 LED2.2
  Bottom 0.254: v17.78,32.26 19.56,34.04 v19.56,36.83
N$18
  Top 0.254: RN5.3 13.97,44.2 13.97,42.42 14.48,41.91 LED3.3
N$19  (via drill 0.61)
  Top 0.254: v12.95,42.93 12.95,44.2 RN5.2 | v12.95,39.62 14.48,38.1 LED3.1
  Bottom 0.254: v12.95,39.62 v12.95,42.93
N$20
  Top 0.254: RN5.1 11.94,44.2 11.94,42.67 13.21,41.4 13.21,41.15 14.48,39.88 LED3.2
RED  (via drill 0.61)
  Top 0.254: v39.37,35.05 38.35,35.05 RN3.8 | v42.67,46.99 42.16,47.5 41.4,47.5 RN2.8 | v17.78,33.53 18.8,33.53 RN4.8 | v14.99,24.64 14.99,26.16 Q5.2 | v10.92,44.7 11.94,45.72 RN5.8 | v32.26,32.77 v39.37,32.77 | v21.84,25.65 v27.94,31.75
  Bottom 0.254: v42.67,46.99 41.66,45.97 41.66,37.34 v39.37,35.05 v39.37,32.77 | 15.49,31.24 14.99,30.73 v14.99,24.64 | 15.49,31.24 16.26,32 | 16.26,32 v17.78,33.53 | v10.92,44.7 10.92,35.81 15.49,31.24 | v32.26,32.77 31.75,32.77 31.5,33.02 30.99,33.02 29.72,31.75 v27.94,31.75 | v21.84,25.65 21.84,26.42 16.26,32
RESET  (via drill 0.61)
  Top 0.254: v33.27,18.54 32.51,18.54 32,18.03 IC1.29 | v32,7.87 32,6.35 RRST.1
  Bottom 0.254: 33.53,18.29 37.08,14.73 43.18,14.73 ISP.5 43.18,14.48 44.2,13.46 45.97,13.46 46.99,12.45 46.99,9.14 45.72,7.87 v32,7.87 | 33.53,18.29 40.89,25.65 40.89,26.42 37.85,29.46 37.85,39.62 36.32,41.15 36.32,45.72 N1.1 | 33.53,18.29 v33.27,18.54
RXD  (via drill 0.61)
  Top 0.254: v30.73,14.99 30.73,17.78 31.24,18.29 IC1.30 | v26.42,32.77 v22.61,28.96
  Bottom 0.254: v30.73,14.99 32,13.72 32.51,13.72 33.27,14.48 33.27,14.99 29.21,19.05 28.7,19.05 22.86,24.89 22.86,28.7 v22.61,28.96 | v26.42,32.77 26.42,33.27 27.43,34.29 27.43,41.91 24.64,44.7 24.64,49.02 SV2.3
SCK
  Top 0.254: IC1.17 30.48,9.4 30.48,5.84 31.24,5.08 36.32,5.08 43.18,11.94 ISP.3
SCL  (via drill 0.61)
  Top 0.254: SV2.6 32.26,49.02 32.26,44.45 30.23,42.42 30.23,41.91 28.96,40.64 28.19,40.64 LUXNIR.CLK | LUXRGB.2 25.65,38.1 v24.64,37.08 | v19.56,23.37 20.57,22.35 20.57,19.81 R15.1 20.83,19.56 21.84,18.54 23.62,18.54 v27.43,22.35 | v21.84,24.38 22.35,24.38 24.64,26.67 U1.1 | v33.78,24.13 34.54,24.89 34.54,25.91 RIR2.1 | v41.91,26.67 40.39,25.15 38.61,25.15 v38.1,25.65
  Bottom 0.254: v24.64,37.08 24.64,26.67 U1.1 | v19.56,23.37 20.07,23.37 20.32,23.62 21.08,23.62 v21.84,24.38 | v27.43,22.35 29.21,24.13 v33.78,24.13 35.31,25.65 v38.1,25.65 | SV2.6 33.53,47.75 36.58,47.75 38.35,45.97 38.35,30.23 v41.91,26.67
SDA  (via drill 0.61)
  Top 0.254: v29.46,38.61 28.45,38.61 LUXRGB.6 | LUXNIR.DATA 28.19,41.91 28.45,41.91 v29.46,42.93 29.46,44.2 29.72,44.45 29.72,49.02 SV2.5 | v14.73,20.57 13.21,22.1 R14.1 | v23.37,19.56 23.37,20.32 27.18,24.13 U1.2 27.43,24.13 27.43,27.43 30.73,30.73 31.24,30.73 32,29.97 33.27,29.97 | 33.27,29.97 33.78,29.97 RIR1.1 | 33.27,29.97 v33.27,31.5
  Bottom 0.254: v29.46,42.93 v29.46,38.61 33.27,34.8 v33.27,31.5 | v14.73,20.57 15.75,19.56 v23.37,19.56
TXD  (via drill 0.61)
  Top 0.254: v29.21,20.07 29.21,19.3 29.97,18.54 30.23,18.54 30.73,19.05 IC1.31
  Bottom 0.254: v29.21,20.07 28.45,20.07 25.91,22.61 25.91,24.64 29.46,28.19 32.51,28.19 35.56,31.24 35.56,38.86 29.72,44.7 29.72,46.99 28.45,48.26 27.94,48.26 SV2.4
VBAT  (via drill 0.61)
  Top 0.254: 6.35,31.75 6.35,32.26 7.11,33.02 J1.2 | 6.35,31.75 6.35,30.99 5.08,29.72 3.81,29.72 3.05,30.48 3.05,30.73 1.78,32 1.78,33.02 J1.5 | 19.81,10.92 19.81,11.94 16,15.75 16,16.26 15.75,16.51 11.68,16.51 10.41,15.24 5.08,15.24 4.83,15.49 4.83,16.76 6.1,18.03 6.86,18.03 | 6.86,18.03 7.37,18.03 CN1.1 6.86,18.03 | v6.86,31.75 6.35,31.75 | 6.86,18.03 v6.86,19.56 | v39.12,3.3 44.45,3.3 BAT1.P$2 | 19.81,10.92 v18.8,9.91 | 19.81,10.92 IC2.3
  Bottom 0.254: v6.86,19.56 v6.86,31.75 | v39.12,3.3 31.75,3.3 27.43,7.62 26.67,7.62 24.38,9.91 v18.8,9.91
VBUS  (via drill 0.61)
  Top 0.254: 29.72,1.52 29.46,1.27 27.94,1.27 27.18,2.03 27.18,2.54 C1.1 26.92,2.54 22.61,6.86 22.61,8.89 22.1,9.4 21.59,9.4 20.57,8.38 20.07,8.38 IC2.4 19.81,8.13 v18.03,6.35 | 29.72,1.52 30.48,2.29 32.77,2.29 RN1.5 | v10.67,8.89 9.91,8.13 8.89,8.13 X1.VBUS | 29.72,1.52 36.07,1.52 38.86,4.32 39.62,4.32 44.7,9.4 45.72,9.4 ISP.2
  Bottom 0.254: v10.67,8.89 11.43,8.89 13.97,6.35 v18.03,6.35
VCC  (via drill 0.61)
  Top 0.254: 16.76,28.19 18.54,28.19 19.05,27.69 C4.2 | 16.76,28.19 13.97,28.19 Q5.3 13.97,28.45 12.7,29.72 12.7,31.24 13.21,31.75 13.21,32.51 Q6.3 13.21,32.77 12.7,32.77 v9.91,35.56 | 16,20.57 16.76,21.34 16.76,28.19 | 16,20.57 14.99,19.56 14.99,19.05 C3.1 | v10.92,46.48 8.64,44.2 U$1.+ | v23.62,3.3 22.61,2.29 IC4.2 | v17.27,8.38 17.27,9.65 14.99,11.94 RU.2 | v27.18,16 26.16,16 25.4,16.76 IC1.6 | IC1.4 26.42,17.78 v25.4,18.8 29.72,23.11 29.72,26.67 U1.3 | 33.27,7.87 33.78,7.37 33.78,6.86 | 33.27,7.87 32.26,8.89 32,8.89 30.99,9.91 IC1.18 | 33.78,6.86 33.78,6.35 RRST.2 33.78,6.86 | 36.58,30.23 36.32,30.23 36.07,29.97 RIR1.2 | 36.58,30.23 v39.88,30.23 41.15,30.23 Q7.3 | 36.58,30.23 36.58,27.43 | 36.58,27.43 36.58,26.16 RIR2.2 36.58,25.91 38.35,24.13 38.35,12.95 33.27,7.87 | 36.58,27.43 v35.56,27.43 | 33.78,6.86 v36.83,6.86 | v16.26,20.57 16,20.57
  Bottom 0.254: N1.6 23.37,45.72 23.37,47.75 SV2.2 19.05,48.26 16,48.26 14.73,49.53 J2.1 14.48,49.53 12.7,51.31 11.43,51.31 10.92,50.8 v10.92,46.48 9.91,45.47 v9.91,35.56 | v17.27,8.38 21.08,8.38 23.62,5.84 v23.62,3.3 28.19,3.3 29.21,2.29 39.37,2.29 40.13,3.05 40.13,3.56 v36.83,6.86 | v27.18,16 27.18,17.02 v25.4,18.8 23.62,20.57 23.11,20.57 22.86,20.32 17.02,20.32 16.76,20.57 v16.26,20.57 | v39.88,30.23 44.2,34.54 48.26,34.54 THM1.2 | U1.3 30.48,26.67 31.5,25.65 33.78,25.65 v35.56,27.43
VDD  (via drill 0.61)
  Top 0.254: J1.4 1.78,35.56 3.05,35.56 3.81,36.32 6.35,36.32 7.11,35.56 J1.1 7.37,35.31 7.37,34.54 8.38,33.53 v8.38,28.96 | IC4.3 21.59,4.83 v19.81,6.6 | v14.22,7.37 13.21,8.38 13.21,8.89 C2.1
  Bottom 0.254: v19.81,6.6 19.3,6.6 18.54,7.37 v14.22,7.37 8.38,13.21 v8.38,28.96